# Altium schematic sheet HPF.SCHDOC
size B
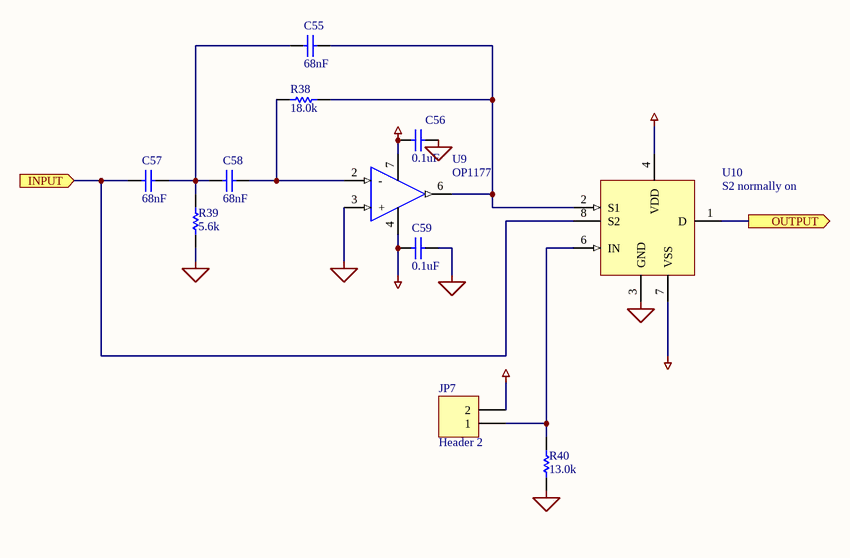
[diagram p0: HPF.SCHDOC]

## Parts
C55  value 68nF  [CC3216-1206]  (hidden comment: Cap)
C56  value 0.1uF  [CC1608-0603]  (hidden comment: Cap)
C57  value 68nF  [CC3216-1206]  (hidden comment: Cap)
C58  value 68nF  [CC3216-1206]  (hidden comment: Cap)
C59  value 0.1uF  [CC1608-0603]  (hidden comment: Cap)
JP7  Header 2  [HDR1X2]
R38  value 18.0k  [CC2012-0805]  (hidden comment: Res1)
R39  value 5.6k  [CC2012-0805]  (hidden comment: Res1)
R40  value 13.0k  [CC2012-0805]  (hidden comment: Res1)
U9  OP1177  [SO-G8/X.6]
U10  S2 normally on  [MSOP8]

## Ports
INPUT (in), OUTPUT (out)

## Nets
AGND: C56.2 C59.2 R39.1 R40.1 U9.3(+) U10.3(GND)
AVDD: C56.1 JP7.2 U9.7(+Vs) U10.4(VDD)
AVSS: C59.1 U9.4(-Vs) U10.7(VSS)
INPUT: C57.2 U10.8(S2) ; port INPUT
OUTPUT: U10.1(D) ; port OUTPUT
NetC55_1: C55.1 R38.1 U9.6(Out) U10.2(S1)
NetC55_2: C55.2 C57.1 C58.2 R39.2
NetC58_1: C58.1 R38.2 U9.2(-)
NetJP7_1: JP7.1 R40.2 U10.6(IN)

## Library data of the parts
C55-C59 = Cap: Capacitor; Manufacturer: Generic Components; Class I: Passive; Published: 8-Jun-2000; Revision: July-2002: Re-released for DXP Platform.; Publisher: Altium Limited; Class II: Capacitor
JP7 = Header 2: Header, 2-Pin; Manufacturer: Generic Components; Class I: Connector; Revision: July-2002: Re-released for DXP Platform.; Publisher: Altium Limited
R38-R40 = Res1: Resistor; Manufacturer: Generic Components; Class I: Passive; Published: 8-Jun-2000; Revision: July-2002: Re-released for DXP Platform.; Publisher: Altium Limited; Class II: Resistor
U9 = OP1177: AD Precision Low Noise, Low Input Bias Current Operational Amplifier
U10 = ADG619: Low RON SPDT Switch